# EAGLE design Boost Gauge MainBoard (EAGLE 9.6.2)
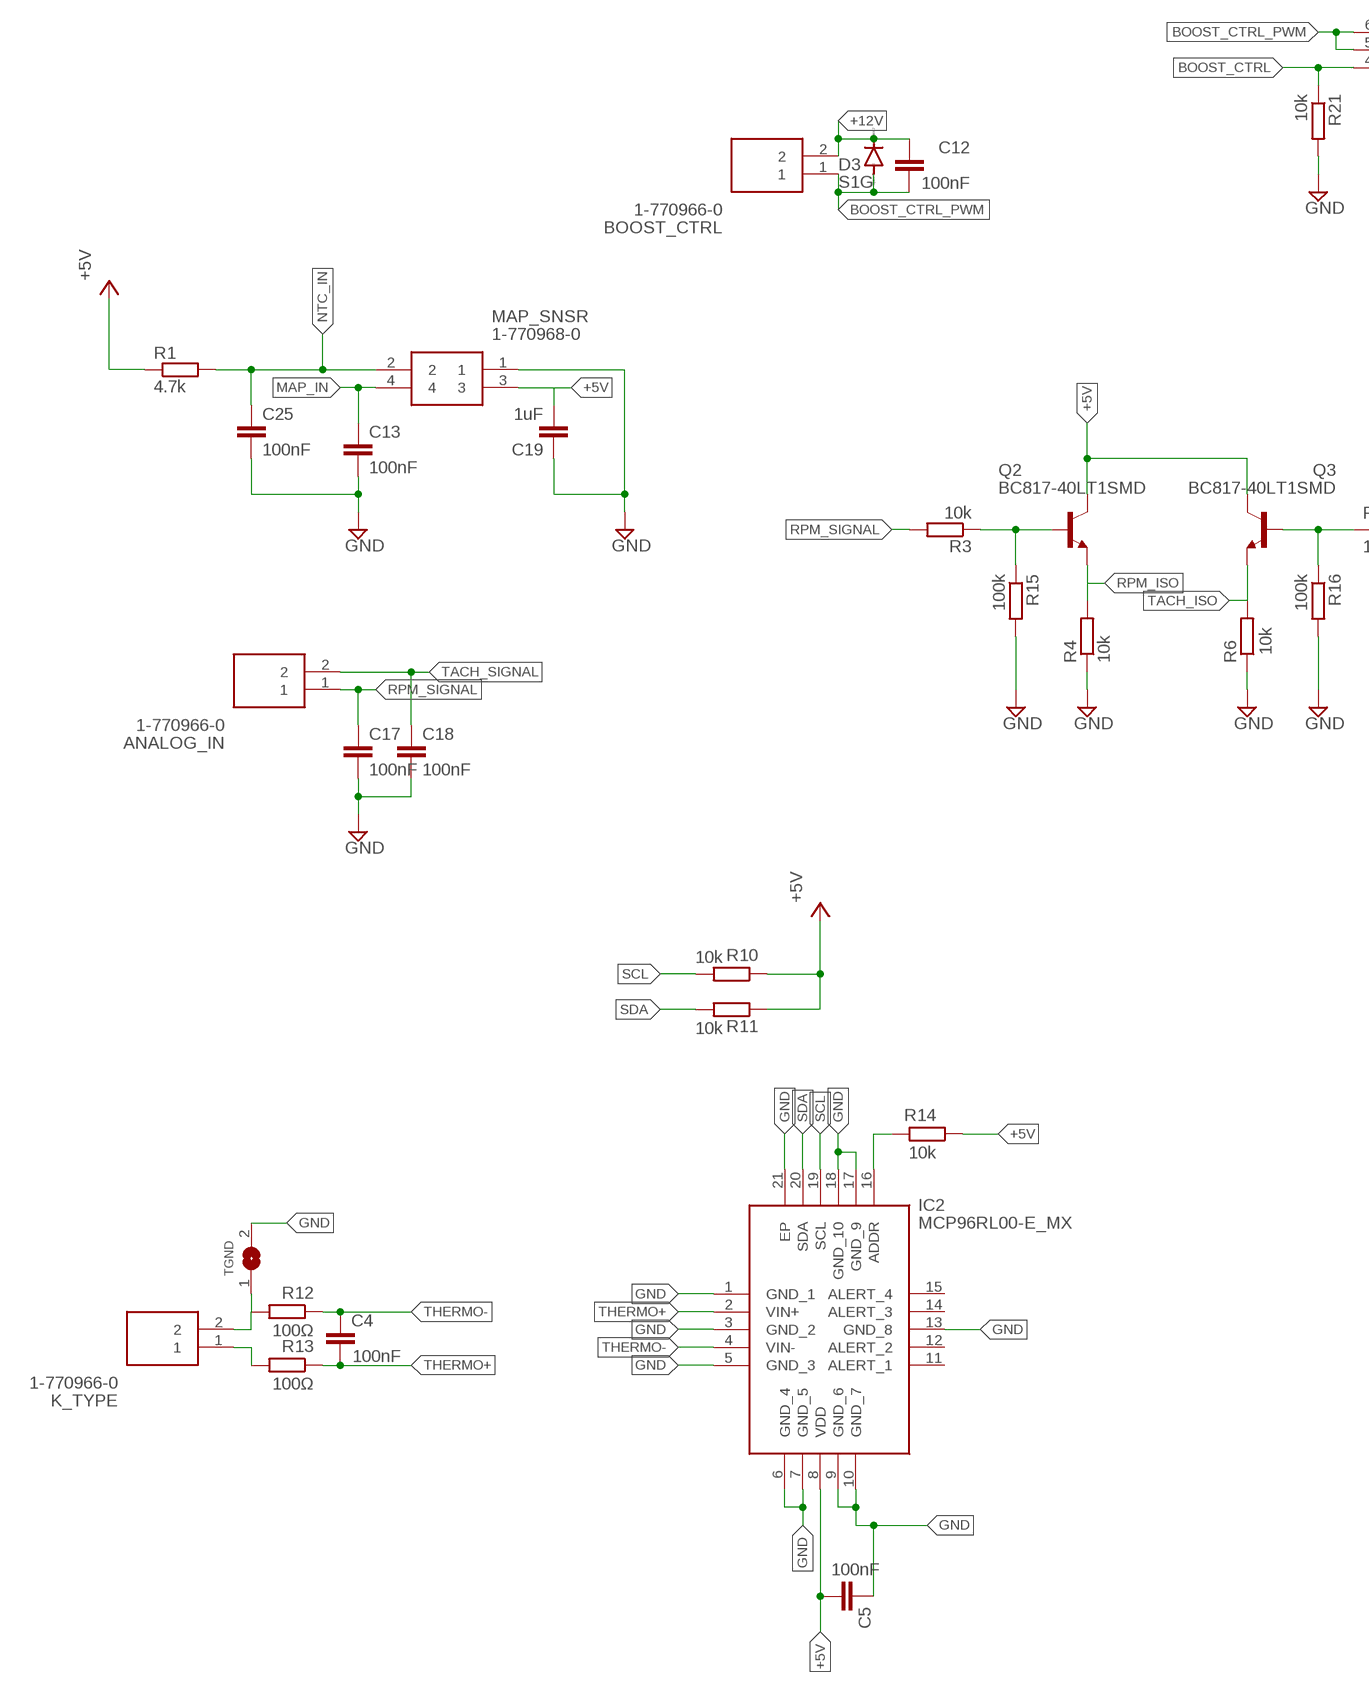
[diagram p0: schematic, sheet 1, part 1 of 2]
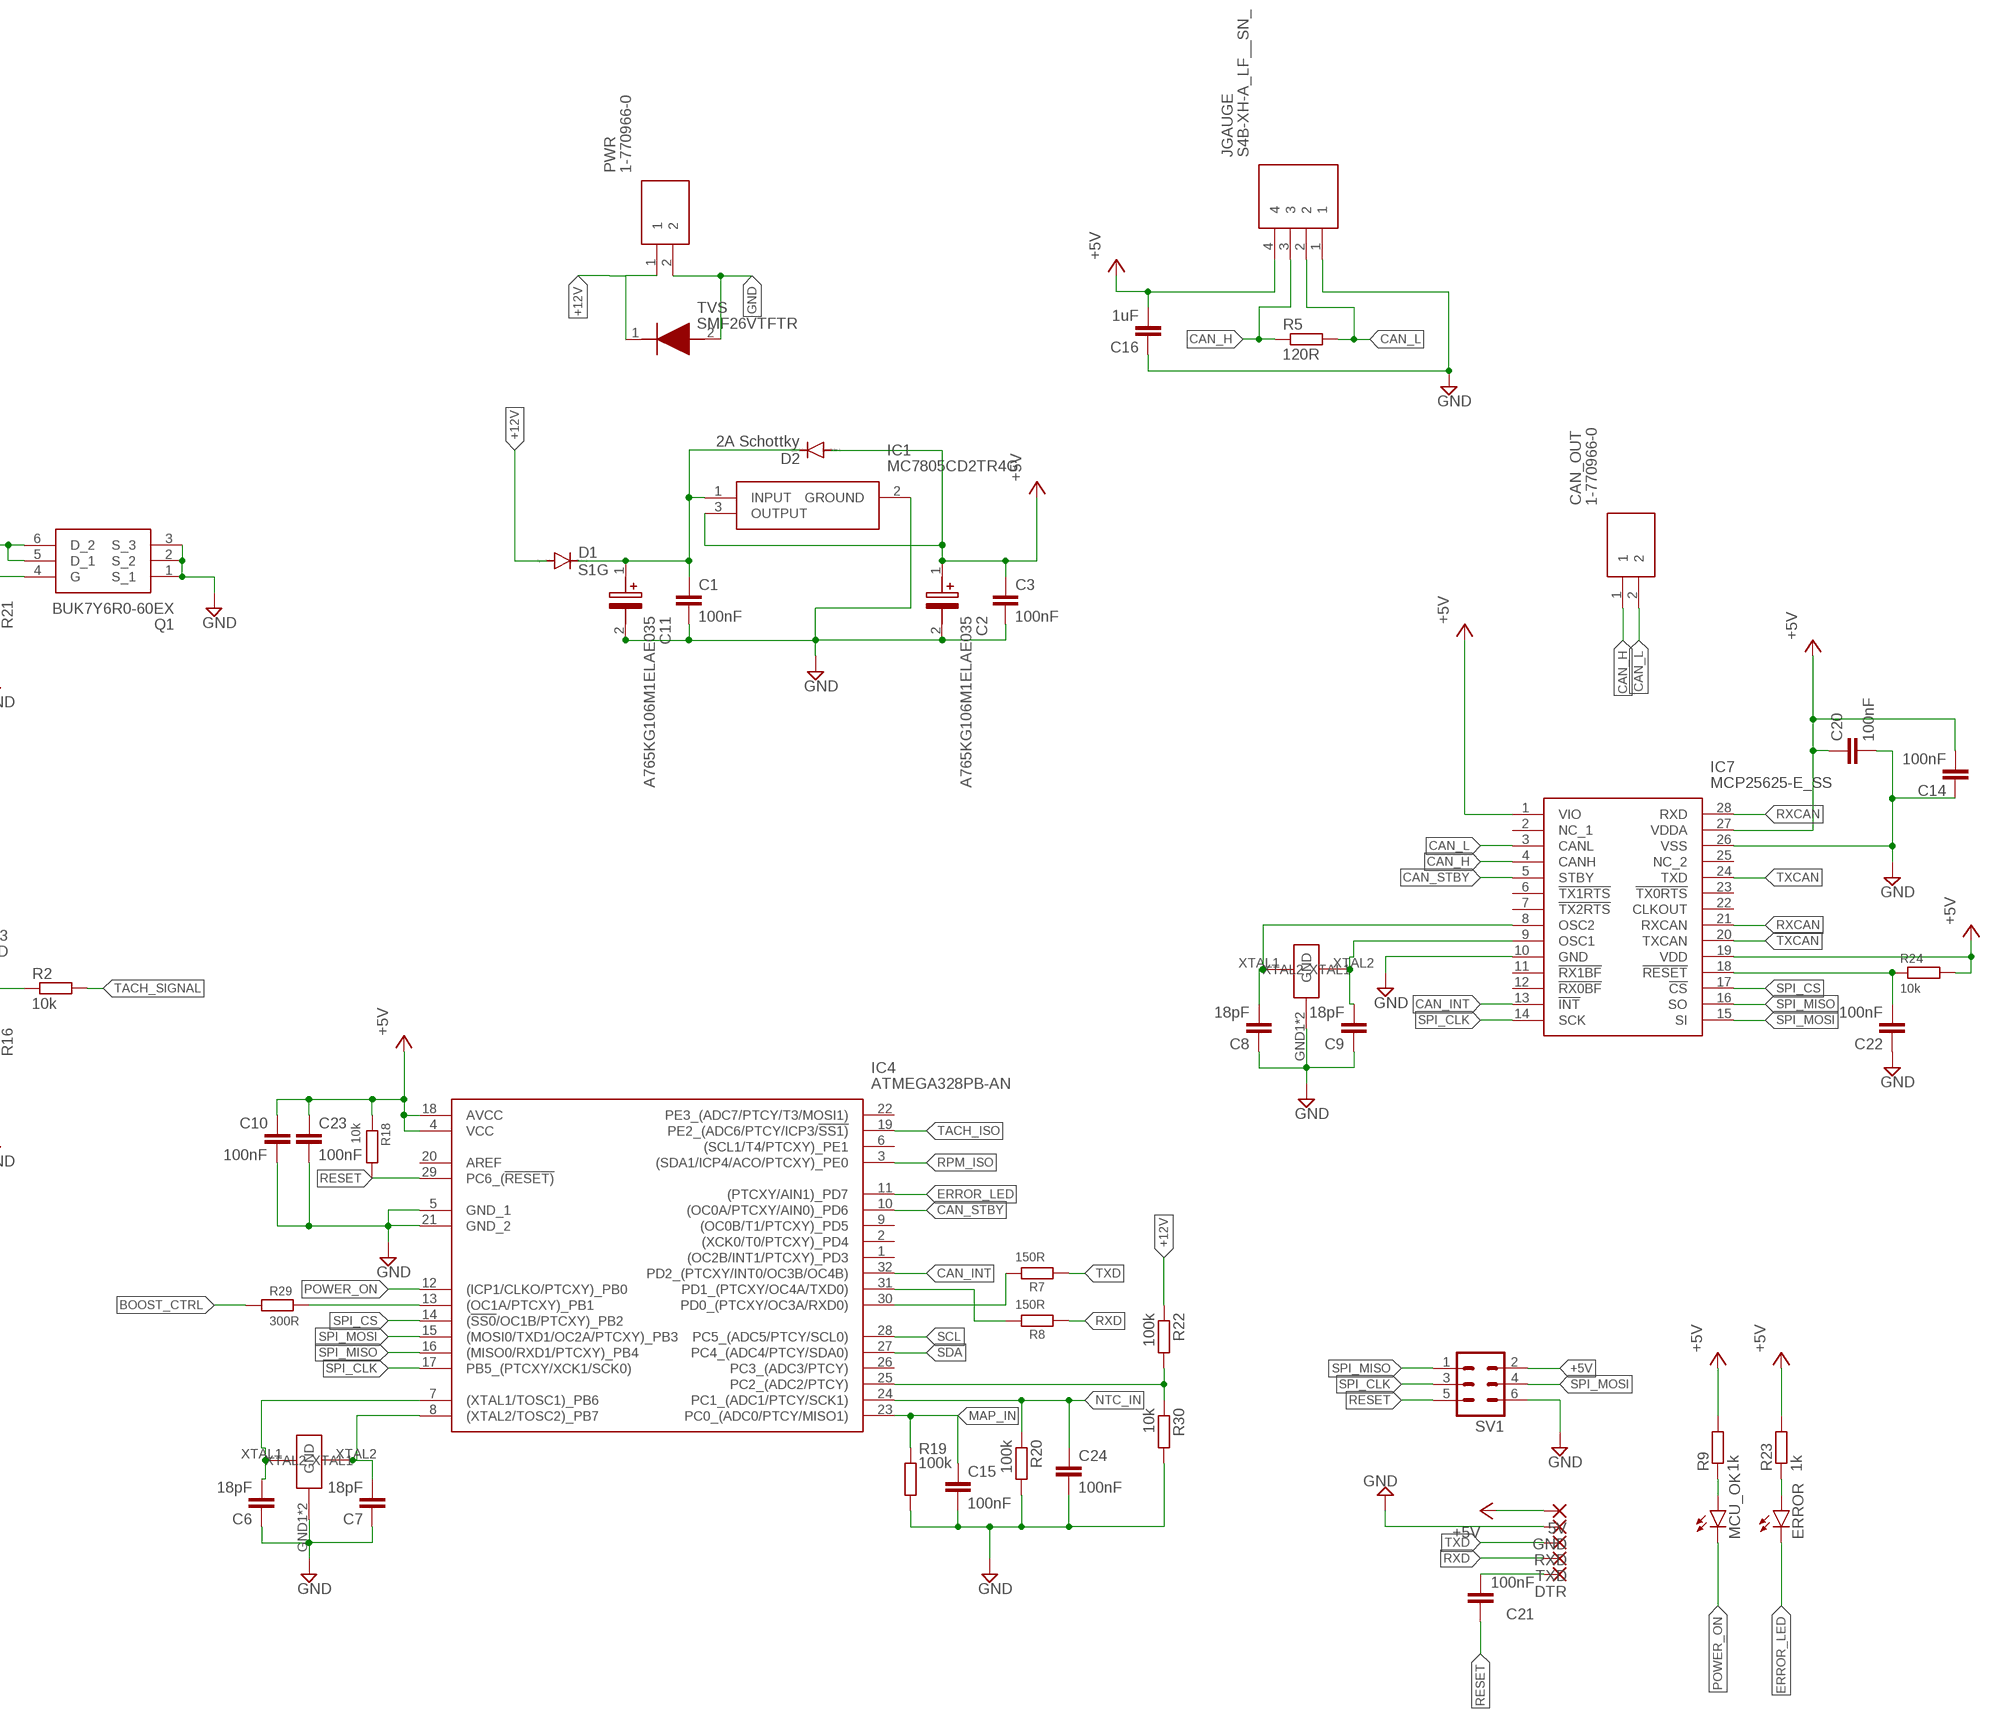
[diagram p1: schematic, sheet 1, part 2 of 2]

## Parts
5V  1,6/0,9  [1,6/0,9]
ANALOG_IN  1-770966-0  [17709660]
BOOST_CTRL  1-770966-0  [17709660]
C1  100nF  C-EUC0805  [C0805]
C2  A765KG106M1ELAE035  [CAPAE830X730N]
C3  100nF  C-EUC0805  [C0805]
C4  100nF  C-EUC0805  [C0805]
C5  100nF  C-EUC0805  [C0805]
C6  18pF  C-EUC0805  [C0805]
C7  18pF  C-EUC0805  [C0805]
C8  18pF  C-EUC0805  [C0805]
C9  18pF  C-EUC0805  [C0805]
C10  100nF  C-EUC0805  [C0805]
C11  A765KG106M1ELAE035  [CAPAE830X730N]
C12  100nF  C-EUC0805  [C0805]
C13  100nF  C-EUC0805  [C0805]
C14  100nF  C-EUC0805  [C0805]
C15  100nF  C-EUC0805  [C0805]
C16  1uF  C-EUC0805  [C0805]
C17  100nF  C-EUC0805  [C0805]
C18  100nF  C-EUC0805  [C0805]
C19  1uF  C-EUC0805  [C0805]
C20  100nF  C-EUC0805  [C0805]
C21  100nF  C-EUC0805  [C0805]
C22  100nF  C-EUC0805  [C0805]
C23  100nF  C-EUC0805  [C0805]
C24  100nF  C-EUC0805  [C0805]
C25  100nF  C-EUC0805  [C0805]
CAN_OUT  1-770966-0  [17709660]
D1  S1G  DIODE-DO-214AC  [DO-214AC]
D2  2A Schottky  DIODE-DO-214AC  [DO-214AC]
D3  S1G  DIODE-DO-214AC  [DO-214AC]
DTR  1,6/0,9  [1,6/0,9]
ERROR  LEDCHIPLED_1206  [CHIPLED_1206]
GND  1,6/0,9  [1,6/0,9]
IC1  MC7805CD2TR4G  [MC7805CD2TR4G]
IC2  MCP96RL00-E_MX  [QFN65P500X500X100-21N]
IC4  ATMEGA328PB-AN  [QFP80P900X900X120-32N]
IC7  MCP25625-E_SS  [SOP65P780X200-28N]
JGAUGE  S4B-XH-A_LF__SN_  [S4BXHALFSN]
K_TYPE  1-770966-0  [17709660]
MAP_SNSR  1-770968-0  [17709680]
MCU_OK  LEDCHIPLED_1206  [CHIPLED_1206]
PWR  1-770966-0  [17709660]
Q1  BUK7Y6R0-60EX  [BUK7Y6R060EX]
Q2  BC817-40LT1SMD  [SOT23-BEC]
Q3  BC817-40LT1SMD  [SOT23-BEC]
R1  4.7k  R-EU_R0805  [R0805]
R2  10k  R-EU_R0805  [R0805]
R3  10k  R-EU_R0805  [R0805]
R4  10k  R-EU_R0805  [R0805]
R5  120R  R-EU_R1206  [R1206]
R6  10k  R-EU_R0805  [R0805]
R7  150R  R-EU_R0805  [R0805]
R8  150R  R-EU_R0805  [R0805]
R9  1k  R-EU_R0805  [R0805]
R10  10k  R-EU_R0805  [R0805]
R11  10k  R-EU_R0805  [R0805]
R12  100Ω  R-EU_R0805  [R0805]
R13  100Ω  R-EU_R0805  [R0805]
R14  10k  R-EU_R0805  [R0805]
R15  100k  R-EU_R0805  [R0805]
R16  100k  R-EU_R0805  [R0805]
R18  10k  R-EU_R0805  [R0805]
R19  100k  R-EU_R0805  [R0805]
R20  100k  R-EU_R0805  [R0805]
R21  10k  R-EU_R0805  [R0805]
R22  100k  R-EU_R0805  [R0805]
R23  1k  R-EU_R0805  [R0805]
R24  10k  R-EU_R0805  [R0805]
R29  300R  R-EU_R0805  [R0805]
R30  10k  R-EU_R0805  [R0805]
RXD  1,6/0,9  [1,6/0,9]
SV1  MA03-2  [MA03-2]
TGND  SOLDERJUMPER  [SOLDERJUMPER_ARROW_NOPASTE]
TVS  SMF26VTFTR  [SMF26VTFTR]
TXD  1,6/0,9  [1,6/0,9]
U$4  E3X160181X04  [E3X160181X04]
U$5  E3X160181X04  [E3X160181X04]

## Nets
+5V: 5V.1(P) C2.1(+) C3.1 C5.2 C10.1 C14.2 C16.2 C19.2 C20.1 C23.1 D2.A IC1.3(OUTPUT) IC2.8(VDD) IC4.4(VCC) IC4.18(AVCC) IC7.1(VIO) IC7.19(VDD) IC7.27(VDDA) JGAUGE.4 MAP_SNSR.3 Q2.C Q3.C R1.1 R9.2 R10.1 R11.1 R14.1 R18.1 R23.2 R24.2 SV1.2
+12V: BOOST_CTRL.2 C12.2 D1.A D3.C PWR.1 R22.1 TVS.1(K)
BOOST_CTRL: Q1.4(G) R21.1 R29.1
BOOST_CTRL_PWM: BOOST_CTRL.1 C12.1 D3.A Q1.5(D_1) Q1.6(D_2)
CAN_H: CAN_OUT.1 IC7.4(CANH) JGAUGE.3 R5.1
CAN_INT: IC4.32(PD2_(PTCXY/INT0/OC3B/OC4B)) IC7.13(!INT)
CAN_L: CAN_OUT.2 IC7.3(CANL) JGAUGE.2 R5.2
CAN_STBY: IC4.10((OC0A/PTCXY/AIN0)_PD6) IC7.5(STBY)
DTR: C21.2 DTR.1(P)
ERROR_LED: ERROR.C IC4.11((PTCXY/AIN1)_PD7)
GND: C1.2 C2.2(-) C3.2 C5.1 C6.1 C7.1 C8.1 C9.1 C10.2 C11.2(-) C13.2 C14.1 C15.2 C16.1 C17.2 C18.2 C19.1 C20.2 C22.1 C23.2 C24.2 C25.2 GND.1(P) IC1.2(GROUND) IC2.1(GND_1) IC2.3(GND_2) IC2.5(GND_3) IC2.6(GND_4) IC2.7(GND_5) IC2.9(GND_6) IC2.10(GND_7) IC2.13(GND_8) IC2.17(GND_9) IC2.18(GND_10) IC2.21(EP) IC4.5(GND_1) IC4.21(GND_2) IC7.10(GND) IC7.26(VSS) JGAUGE.1 MAP_SNSR.1 PWR.2 Q1.1(S_1) Q1.2(S_2) Q1.3(S_3) R4.1 R6.1 R15.2 R16.2 R19.2 R20.2 R21.2 R30.2 SV1.6 TGND.2 TVS.2(A) U$4.GND1(GND) U$4.GND2(GND) U$5.GND1(GND) U$5.GND2(GND)
MAP_IN: C13.1 C15.1 IC4.23(PC0_(ADC0/PTCY/MISO1)) MAP_SNSR.4 R19.1
N$1: C9.2 IC7.9(OSC1) U$5.XTAL2
N$3: Q2.B R3.1 R15.1
N$4: Q3.B R2.1 R16.1
N$5: C8.2 IC7.8(OSC2) U$5.XTAL1
N$6: C1.1 C11.1(+) D1.C D2.C IC1.1(INPUT)
N$8: IC4.31(PD1_(PTCXY/OC4A/TXD0)) R8.2
N$9: IC4.30(PD0_(PTCXY/OC3A/RXD0)) R7.2
N$10: MCU_OK.A R9.1
N$11: K_TYPE.1 R13.2
N$12: ERROR.A R23.1
N$13: C22.2 IC7.18(!RESET) R24.1
N$15: IC2.16(ADDR) R14.2
N$23: IC4.25(PC2_(ADC2/PTCY)) R22.2 R30.1
N$24: C7.2 IC4.8((XTAL2/TOSC2)_PB7) U$4.XTAL2
N$25: C6.2 IC4.7((XTAL1/TOSC1)_PB6) U$4.XTAL1
N$32: IC4.13((OC1A/PTCXY)_PB1) R29.2
NTC_IN: C24.1 C25.1 IC4.24(PC1_(ADC1/PTCY/SCK1)) MAP_SNSR.2 R1.2 R20.1
POWER_ON: IC4.12((ICP1/CLKO/PTCXY)_PB0) MCU_OK.C
RESET: C21.1 IC4.29(PC6_(!RESET)) R18.2 SV1.5
RPM_ISO: IC4.3((SDA1/ICP4/ACO/PTCXY)_PE0) Q2.E R4.2
RPM_SIGNAL: ANALOG_IN.1 C17.1 R3.2
RXCAN: IC7.21(RXCAN) IC7.28(RXD)
RXD: R8.1 TXD.1(P)
SCL: IC2.19(SCL) IC4.28(PC5_(ADC5/PTCY/SCL0)) R10.2
SDA: IC2.20(SDA) IC4.27(PC4_(ADC4/PTCY/SDA0)) R11.2
SPI_CLK: IC4.17(PB5_(PTCXY/XCK1/SCK0)) IC7.14(SCK) SV1.3
SPI_CS: IC4.14((!SS0!/OC1B/PTCXY)_PB2) IC7.17(!CS)
SPI_MISO: IC4.16((MISO0/RXD1/PTCXY)_PB4) IC7.16(SO) SV1.1
SPI_MOSI: IC4.15((MOSI0/TXD1/OC2A/PTCXY)_PB3) IC7.15(SI) SV1.4
TACH_ISO: IC4.19(PE2_(ADC6/PTCY/ICP3/!SS1)) Q3.E R6.2
TACH_SIGNAL: ANALOG_IN.2 C18.1 R2.2
THERMO+: C4.2 IC2.2(VIN+) R13.1
THERMO-: C4.1 IC2.4(VIN-) R12.1
THERMO-1: K_TYPE.2 R12.2 TGND.1
TXCAN: IC7.20(TXCAN) IC7.24(TXD)
TXD: R7.1 RXD.1(P)
Unconnected: IC2.11(ALERT_1) IC2.12(ALERT_2) IC2.14(ALERT_3) IC2.15(ALERT_4) IC4.1((OC2B/INT1/PTCXY)_PD3) IC4.2((XCK0/T0/PTCXY)_PD4) IC4.6((SCL1/T4/PTCXY)_PE1) IC4.9((OC0B/T1/PTCXY)_PD5) IC4.20(AREF) IC4.22(PE3_(ADC7/PTCY/T3/MOSI1)) IC4.26(PC3_(ADC3/PTCY)) IC7.2(NC_1) IC7.6(!TX1RTS) IC7.7(!TX2RTS) IC7.11(!RX1BF) IC7.12(!RX0BF) IC7.22(CLKOUT) IC7.23(!TX0RTS) IC7.25(NC_2)

## Library data of the parts
5V DTR GND RXD TXD = wirepad:1,6/0,9: THROUGH-HOLE PAD
ANALOG_IN BOOST_CTRL CAN_OUT K_TYPE PWR = 1-770966-0:1-770966-0: TE Connectivity MATE-N-LOK Series, 4.14mm Pitch 2 Way Right Angle Heavy Duty Power Connector, Solder Termination, 9.5A Source: Datasheet <https://www.te.com/commerce/DocumentDelivery/DDEController?Action=showdoc&DocId=Customer Drawing770966G1pdfEnglishENG_CD_770966_G1.pdf1-770966-0>; DESCRIPTION: TE Connectivity MATE-N-LOK Series, 4.14mm Pitch 2 Way Right Angle Heavy Duty Power Connector, Solder Termination, 9.5A; HEIGHT: 7.77mm; MANUFACTURER_NAME: TE Connectivity; MANUFACTURER_PART_NUMBER: 1-770966-0; MOUSER_PART_NUMBER: 571-1-770966-0; MOUSER_PRICE-STOCK: https://www.mouser.co.uk/ProductDetail/TE-Connectivity-AMP/1-770966-0?qs=qXO2HHLAcoJiZj6lD7oupQ%3D%3D
C1 C3-C10 C12-C25 = rcl:C-EU: CAPACITOR, European symbol; SPICEPREFIX: C
C2 C11 = A765KG106M1ELAE035:A765KG106M1ELAE035: A765, Aluminum, Polymer Aluminum, 10 uF, 20%, 25 VDC, -55/+105C, 105C, -55C, 105C, 2,000 Hrs, 35 mOhms, 125 uA, 8mm, 7mm Source: Datasheet <https://content.kemet.com/datasheets/KEM_A4070_A765.pdf>; DESCRIPTION: A765, Aluminum, Polymer Aluminum, 10 uF, 20%, 25 VDC, -55/+105C, 105C, -55C, 105C, 2,000 Hrs, 35 mOhms, 125 uA, 8mm, 7mm; HEIGHT: 7.3mm; MANUFACTURER_NAME: KEMET; MANUFACTURER_PART_NUMBER: A765KG106M1ELAE035; MOUSER_PART_NUMBER: 80-A765KG106M1ELAE35; MOUSER_PRICE-STOCK: https://www.mouser.co.uk/ProductDetail/KEMET/A765KG106M1ELAE035?qs=W%2FMpXkg%252BdQ53XAW4ytn24A%3D%3D
D1-D3 = diode:DIODE-: DIODE
ERROR MCU_OK = led:LED: LED OSRAM: - CHIPLED LG R971, LG N971, LY N971, LG Q971, LY Q971, LO R971, LY R971 LH N974, LH R974 LS Q976, LO Q976, LY Q976 LO Q996 - Hyper CHIPLED LW Q18S LB Q993, LB Q99A, LB R99A - SideLED LS A670, LO A670, LY A670, LG A670, LP A670 LB A673, LV A673, LT A673, LW A673 LH A674 LY A675 LS A676, LA A676, LO A676, LY A676, LW A676 LS A679, LY A679, LG A679 - Hyper Micro SIDELED® LS Y876, LA Y876, LO Y876, LY Y876 LT Y87S - SmartLED LW L88C, LW L88S LB L89C, LB L89S, LG L890 LS L89K, LO L89K, LY L89K LS L896, LA L896, LO L896, LY L896 - TOPLED LS T670, LO T670, LY T670, LG T670, LP T670 LSG T670, LSP T670, LSY T670, LOP T670, LYG T670 LG T671, LOG T671, LSG T671 LB T673, LV T673, LT T673, LW T673 LH T674 LS T676, LA T676, LO T676, LY T676, LB T676, LH T676, LSB T676, LW T676 LB T67C, LV T67C, LT T67C, LS T67K, LO T67K, LY T67K, LW E67C LS E67B, LA E67B, LO E67B, LY E67B, LB E67C, LV E67C, LT E67C LW T67C LS T679, LY T679, LG T679 LS T770, LO T770, LY T770, LG T770, LP T770 LB T773, LV T773, LT T773, LW T773 LH T774 LS E675, LA E675, LY E675, LS T675 LS T776, LA T776, LO T776, LY T776, LB T776 LHGB T686 LT T68C, LB T68C - Hyper Mini TOPLED® LB M676 - Mini TOPLED Santana® LG M470 LS M47K, LO M47K, LY M47K Source: http://www.osram.convergy.de LUXEON: - LUMILED® LXK2-PW12-R00, LXK2-PW12-S00, LXK2-PW14-U00, LXK2-PW14-V00 LXK2-PM12-R00, LXK2-PM12-S00, LXK2-PM14-U00 LXK2-PE12-Q00, LXK2-PE12-R00, LXK2-PE12-S00, LXK2-PE14-T00, LXK2-PE14-U00 LXK2-PB12-K00, LXK2-PB12-L00, LXK2-PB12-M00, LXK2-PB14-N00, LXK2-PB14-P00, LXK2-PB14-Q00 LXK2-PR12-L00, LXK2-PR12-M00, LXK2-PR14-Q00, LXK2-PR14-R00 LXK2-PD12-Q00, LXK2-PD12-R00, LXK2-PD12-S00 LXK2-PH12-R00, LXK2-PH12-S00 LXK2-PL12-P00, LXK2-PL12-Q00, LXK2-PL12-R00 Source: www.luxeon.com KINGBRIGHT: KA-3528ASYC Source: www.kingbright.com
IC1 = MC7805CD2TR4G:MC7805CD2TR4G: Linear Voltage Regulator IC Positive Fixed 1 Output 1A D2PAK-3 Source: Datasheet <https://www.onsemi.com/pdf/datasheet/mc7800-d.pdf>; DESCRIPTION: Linear Voltage Regulator IC Positive Fixed 1 Output 1A D2PAK-3; HEIGHT: 4.826mm; MANUFACTURER_NAME: onsemi; MANUFACTURER_PART_NUMBER: MC7805CD2TR4G; MOUSER_PART_NUMBER: 863-MC7805CD2TR4G; MOUSER_PRICE-STOCK: https://www.mouser.co.uk/ProductDetail/onsemi/MC7805CD2TR4G?qs=%252B9%2Fcbd0IE0TA2t8QN7DaSw%3D%3D
IC2 = MCP96RL00-E_MX:MCP96RL00-E_MX: Board Mount Temperature Sensors +/- 8.0C Thermocouple to I2C converter in 5mmx5mm QFN. This device supports K, J, T, N, S, E, B, and R type thermocouples. Source: Datasheet <https://componentsearchengine.com/Datasheets/1/MCP96RL00-E_MX.pdf>; DESCRIPTION: Board Mount Temperature Sensors +/- 8.0C Thermocouple to I2C converter in 5mmx5mm QFN. This device supports K, J, T, N, S, E, B, and R type thermocouples.; HEIGHT: 1mm; MANUFACTURER_NAME: Microchip; MANUFACTURER_PART_NUMBER: MCP96RL00-E/MX; MOUSER_PART_NUMBER: 579-MCP96RL00-E/MX; MOUSER_PRICE-STOCK: https://www.mouser.co.uk/ProductDetail/Microchip-Technology/MCP96RL00-E-MX?qs=u16ybLDytRaPVbMV4dyqRg%3D%3D
IC4 = ATMEGA328PB-AN:ATMEGA328PB-AN: MCU 8-bit ATmega AVR RISC 32KB Flash 2.5V/3.3V/5V 32-Pin TQFP Tray Source: Datasheet <http://ww1.microchip.com/downloads/en/DeviceDoc/40001906C.pdf>; DESCRIPTION: MCU 8-bit ATmega AVR RISC 32KB Flash 2.5V/3.3V/5V 32-Pin TQFP Tray; HEIGHT: 1.2mm; MANUFACTURER_NAME: Microchip; MANUFACTURER_PART_NUMBER: ATMEGA328PB-AN; MOUSER_PART_NUMBER: 556-ATMEGA328PB-AN; MOUSER_PRICE-STOCK: https://www.mouser.co.uk/ProductDetail/Microchip-Technology/ATMEGA328PB-AN?qs=jy4bLUHv09gDoS2J01KCIw%3D%3D
IC7 = MCP25625-E_SS:MCP25625-E_SS: CAN Controller with Transceiver SSOP28 Microchip MCP25625-E/SS, CAN Controller 1MBps CAN 2.0, 28-Pin SSOP Source: Datasheet <https://datasheet.datasheetarchive.com/originals/distributors/Datasheets-DGA14/1192265.pdf>; DESCRIPTION: CAN Controller with Transceiver SSOP28 Microchip MCP25625-E/SS, CAN Controller 1MBps CAN 2.0, 28-Pin SSOP; HEIGHT: 2mm; MANUFACTURER_NAME: Microchip; MANUFACTURER_PART_NUMBER: MCP25625-E/SS; MOUSER_PART_NUMBER: 579-MCP25625-E/SS; MOUSER_PRICE-STOCK: https://www.mouser.co.uk/ProductDetail/Microchip-Technology/MCP25625-E-SS?qs=YlpJWyuQ3PO6FRVW%2Ffac7A%3D%3D
JGAUGE = S4B-XH-A_LF__SN_:S4B-XH-A_LF__SN_: XH-2.5mm Header side entry 4 way JST XH Series, Series Number S4B, 2.5mm Pitch 4 Way 1 Row Right Angle PCB Header, Solder Termination, 3A Source: Datasheet <https://www.mouser.co.uk/ProductDetail/JST-Commercial/S4B-XH-ALFSN?qs=QpmGXVUTftEyAvx%2Br33AyQ==&srsltid=AfmBOopXgwHK5vQKy207Eg2VBdixziHXVBrLkW0Mvqq_XGzuQb0VSmKc>; DESCRIPTION: XH-2.5mm Header side entry 4 way JST XH Series, Series Number S4B, 2.5mm Pitch 4 Way 1 Row Right Angle PCB Header, Solder Termination, 3A; HEIGHT: 7mm; MANUFACTURER_NAME: JST (JAPAN SOLDERLESS TERMINALS); MANUFACTURER_PART_NUMBER: S4B-XH-A(LF)(SN); MOUSER_PART_NUMBER: N/A; MOUSER_PRICE-STOCK: https://www.mouser.co.uk/ProductDetail/JST-Commercial/S4B-XH-ALFSN?qs=QpmGXVUTftF7eeJ4yg3VYQ%3D%3D
MAP_SNSR = 1-770968-0:1-770968-0: PCB Mount Header, Right Angle, Wire-to-Board, 4 Position, 4.14 mm [.162 in] Centerline, Fully Shrouded, Tin, Mini-Universal MATE-N-LOK Source: Datasheet <http://www.te.com/commerce/DocumentDelivery/DDEController?Action=srchrtrv&DocNm=770968&DocType=Customer Drawing&DocLang=English&DocFormat=pdf&PartCntxt=1-770968-0>; DESCRIPTION: PCB Mount Header, Right Angle, Wire-to-Board, 4 Position, 4.14 mm [.162 in] Centerline, Fully Shrouded, Tin, Mini-Universal MATE-N-LOK; HEIGHT: 11.86mm; MANUFACTURER_NAME: TE Connectivity; MANUFACTURER_PART_NUMBER: 1-770968-0; MOUSER_PART_NUMBER: 571-1-770968-0; MOUSER_PRICE-STOCK: https://www.mouser.co.uk/ProductDetail/TE-Connectivity-AMP/1-770968-0?qs=qXO2HHLAcoL4Dw11VWHBrA%3D%3D
Q1 = BUK7Y6R0-60EX:BUK7Y6R0-60EX: MOSFET BUK7Y6R0-60E/SOT669/LFPAK Source: Datasheet <https://assets.nexperia.com/documents/data-sheet/BUK7Y6R0-60E.pdf>; DESCRIPTION: MOSFET BUK7Y6R0-60E/SOT669/LFPAK; HEIGHT: 1.2mm; MANUFACTURER_NAME: Nexperia; MANUFACTURER_PART_NUMBER: BUK7Y6R0-60EX; MOUSER_PART_NUMBER: 771-BUK7Y6R0-60EX; MOUSER_PRICE-STOCK: https://www.mouser.co.uk/ProductDetail/Nexperia/BUK7Y6R0-60EX?qs=cbprxTG2Yq9UL%2F2WHaKVPw%3D%3D
Q2 Q3 = transistor-npn:BC817*: NPN Transistor
R1-R16 R18-R24 R29 R30 = rcl:R-EU_: RESISTOR, European symbol; SPICEPREFIX: R
SV1 = con-lstb:MA03-2: PIN HEADER; OC_FARNELL: unknown; OC_NEWARK: unknown
TGND = microbuilder:SOLDERJUMPER: SMD Solder JUMPER Solder the two pads together to create a connection, or remove the solder to break it. REFLOW - Use this footprint for solder paste and reflow ovens. WAVE - Use this footprint for hand-soldering (larger pads). CLOSED - Has a trace between the two pads to ensure it is closed by default. The trace needs to be cut to disable the jumper, and can be closed again by creating a solder bridge between the two pads.; BOM: EXCLUDE
TVS = SMF26VTFTR:SMF26VTFTR: Transient Voltage Suppressor (AEC-Q101 Qualified) Source: Datasheet <https://fscdn.rohm.com/en/products/databook/datasheet/discrete/diode/zener/smf26vtftr-e.pdf>; DESCRIPTION: Transient Voltage Suppressor (AEC-Q101 Qualified); HEIGHT: 0.9mm; MANUFACTURER_NAME: ROHM Semiconductor; MANUFACTURER_PART_NUMBER: SMF26VTFTR; MOUSER_PART_NUMBER: 755-SMF26VTFTR; MOUSER_PRICE-STOCK: https://www.mouser.co.uk/ProductDetail/ROHM-Semiconductor/SMF26VTFTR?qs=HXFqYaX1Q2zSWViY1YLSPg%3D%3D
U$4 U$5 = E3X160181X04:E3X160181X04

## Board
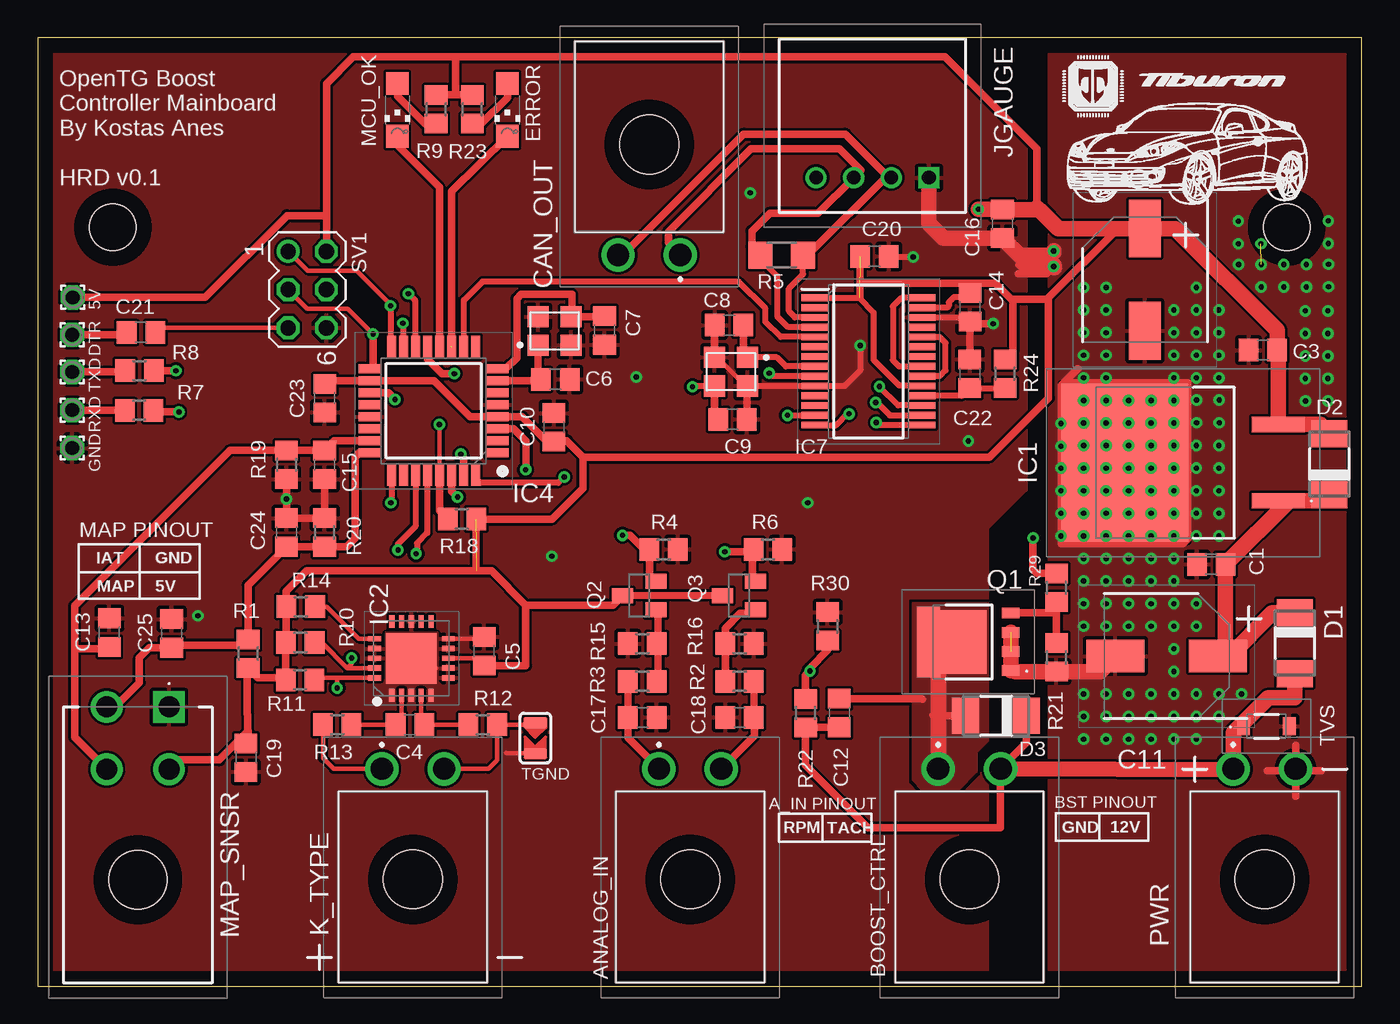
[diagram p2: board, top side]
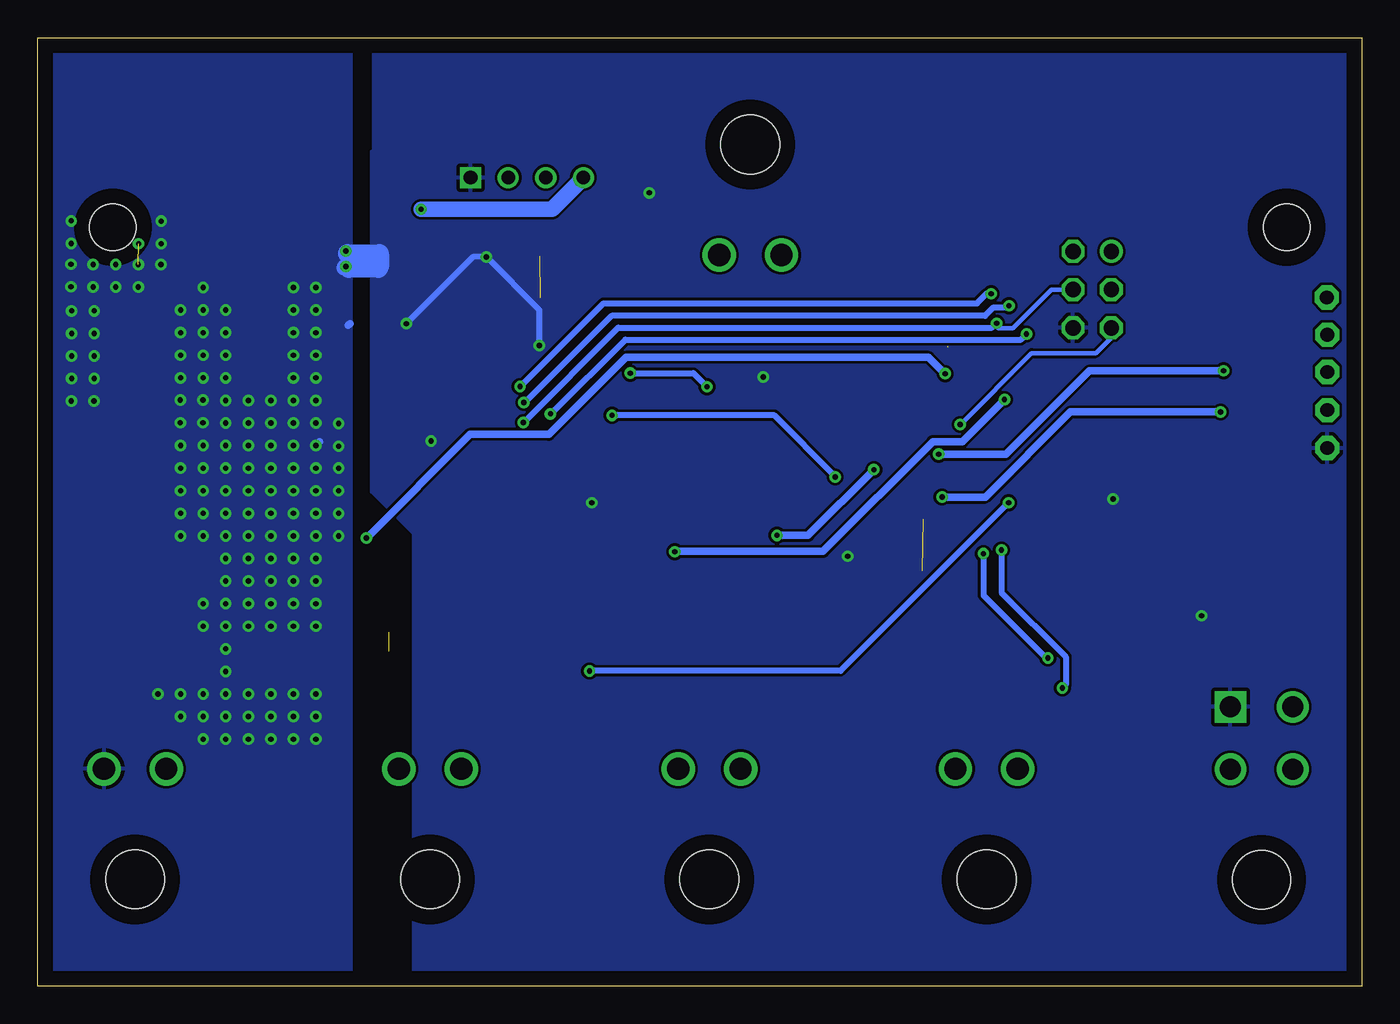
[diagram p3: board, bottom side, seen from below]

Size 88 x 63 mm. Coordinates in mm from the lower left corner, seen from the top.
Outline: 0,0 88,0 88,63 0,63 0,0
Copper layers (1*16): Top 0.035mm / dielectric 1.5mm / Bottom 0.035mm
Design rules "default *": minimum track width 6mil, minimum drill 0.35mm, track to track 7mil, track to pad 6mil, pad to pad 6mil, via to via 6mil, smd to smd 6mil, copper to edge 40mil, drill to drill 6mil, minimum pad ring 1mil, minimum via ring 8mil, stop-mask expansion 4mil, vias tented up to drill 0mil, thermal gap 10mil
Holes 3.1 mm at 83,50.4 5,50.4

### Footprints (pad centres in the part's own frame; a part is rotated, then mirrored left to right if it is on the bottom)
1,6/0,9 = drill 0.914 pad 1.6 octagon: 1 0,0
17709660 = drill 1.48 pad 2.22: 1 0,0; 2 4.14,0 | hole 3.91: 2.07,-7.34
C0805 = smd 1.3 x 1.5: 1 -0.95,0; 2 0.95,0
CAPAE830X730N = smd 3.85 x 2.15: 1 -3.4,0; 2 3.4,0
DO-214AC = smd 1.8 x 2.4: A 2.025,0; C -2.025,0
CHIPLED_1206 = smd 1.5 x 1.5: A 0,-1.75; C 0,1.75
MC7805CD2TR4G = smd 1.016 x 3.504: 1 -2.54,-6.059; 3 2.54,-6.059 | smd 10.49 x 8.38: 2 0,4.154
QFN65P500X500X100-21N = smd 0.85 x 0.35: 1 -2.45,1.3; 2 -2.45,0.65; 3 -2.45,0; 4 -2.45,-0.65; 5 -2.45,-1.3; 11 2.45,-1.3; 12 2.45,-0.65; 13 2.45,0; 14 2.45,0.65; 15 2.45,1.3 | smd 0.35 x 0.85: 6 -1.3,-2.45; 7 -0.65,-2.45; 8 0,-2.45; 9 0.65,-2.45; 10 1.3,-2.45; 16 1.3,2.45; 17 0.65,2.45; 18 0,2.45; 19 -0.65,2.45; 20 -1.3,2.45 | smd 3.35 x 3.35: 21 0,0
QFP80P900X900X120-32N = smd 1.475 x 0.6: 1 -4.238,2.8; 2 -4.238,2; 3 -4.238,1.2; 4 -4.238,0.4; 5 -4.238,-0.4; 6 -4.238,-1.2; 7 -4.238,-2; 8 -4.238,-2.8; 17 4.238,-2.8; 18 4.238,-2; 19 4.238,-1.2; 20 4.238,-0.4; 21 4.238,0.4; 22 4.238,1.2; 23 4.238,2; 24 4.238,2.8 | smd 0.6 x 1.475: 9 -2.8,-4.238; 10 -2,-4.238; 11 -1.2,-4.238; 12 -0.4,-4.238; 13 0.4,-4.238; 14 1.2,-4.238; 15 2,-4.238; 16 2.8,-4.238; 25 2.8,4.238; 26 2,4.238; 27 1.2,4.238; 28 0.4,4.238; 29 -0.4,4.238; 30 -1.2,4.238; 31 -2,4.238; 32 -2.8,4.238
SOP65P780X200-28N = smd 1.8 x 0.45: 1 -3.55,4.225; 2 -3.55,3.575; 3 -3.55,2.925; 4 -3.55,2.275; 5 -3.55,1.625; 6 -3.55,0.975; 7 -3.55,0.325; 8 -3.55,-0.325; 9 -3.55,-0.975; 10 -3.55,-1.625; 11 -3.55,-2.275; 12 -3.55,-2.925; 13 -3.55,-3.575; 14 -3.55,-4.225; 15 3.55,-4.225; 16 3.55,-3.575; 17 3.55,-2.925; 18 3.55,-2.275; 19 3.55,-1.625; 20 3.55,-0.975; 21 3.55,-0.325; 22 3.55,0.325; 23 3.55,0.975; 24 3.55,1.625; 25 3.55,2.275; 26 3.55,2.925; 27 3.55,3.575; 28 3.55,4.225
S4BXHALFSN = drill 0.9 pad 1.4 square: 1 0,0 | drill 0.9 pad 1.4: 2 -2.5,0; 3 -5,0; 4 -7.5,0
17709680 = drill 1.4 pad 2.1 square: 1 0,0 | drill 1.4 pad 2.1: 2 -4.14,0; 3 0,-4.14; 4 -4.14,-4.14 | hole 3.86: -2.07,-11.48
BUK7Y6R060EX = smd 0.7 x 1.15: 1 -1.905,-2.737; 2 -0.635,-2.737; 3 0.635,-2.737; 4 1.905,-2.737 | smd 4.7 x 1.5: 5 0,2.737 | smd 4.2 x 3.1: 6 0,0.438
SOT23-BEC = smd 1 x 1.4: B -0.95,-1.1; C 0,1.1; E 0.95,-1.1
R0805 = smd 1.3 x 1.5: 1 -0.95,0; 2 0.95,0
R1206 = smd 1.6 x 1.803: 1 -1.422,0; 2 1.422,0
MA03-2 = drill 1.016: 1 -2.54,-1.27 | drill 1.016 octagon: 2 -2.54,1.27; 3 0,-1.27; 4 0,1.27; 5 2.54,-1.27; 6 2.54,1.27
SOLDERJUMPER_ARROW_NOPASTE = smd 0.762 x 1.524: 1 -1.016,0; 2 1.016,0
SMF26VTFTR = smd 1.2 x 0.85: 1 0,1.525; 2 0,-1.525
E3X160181X04 = smd 1.4 x 1.4: GND1 -1.1,0.9; GND2 1.1,-1; XTAL1 -1.1,-1; XTAL2 1.1,0.9

### Placement (x,y rotation side)
5V  2.34,45.74 270 top
ANALOG_IN  41.29,14.43 0 top
BOOST_CTRL  59.85,14.43 0 top
C1  77.99,28.01 180 top
C2  73.58,46.92 270 top
C3  81.42,42.25 180 top
C4  24.74,17.36 180 top
C5  29.68,22.24 270 top
C6  34.4,40.3 180 top
C7  37.67,43.55 90 top
C8  45.95,43.9 0 top
C9  46.18,37.64 180 top
C10  34.31,37.11 90 top
C11  75.03,21.92 180 top
C12  53.28,18.14 270 top
C13  4.76,23.48 90 top
C14  61.96,45.09 90 top
C15  19.07,34.63 270 top
C16  64.11,50.63 90 top
C17  40.18,17.84 0 top
C18  46.65,17.84 180 top
C19  13.85,15.17 90 top
C20  55.61,48.47 0 top
C21  6.87,43.42 180 top
C22  61.94,40.67 270 top
C23  19.08,39.05 270 top
C24  16.54,30.13 90 top
C25  8.91,23.42 90 top
CAN_OUT  42.71,48.56 180 top
D1  83.55,22.78 270 top
D2  85.84,34.67 90 top
D3  63.68,17.95 180 top
DTR  2.3,43.26 270 top
ERROR  31.22,58.2 180 top
GND  2.3,35.74 270 top
IC1  76.39,34.77 90 top
IC2  24.84,21.77 90 top
IC4  26.31,38.21 180 top
IC7  55.21,41.49 0 top
JGAUGE  59.23,53.7 0 top
K_TYPE  22.87,14.43 0 top
MAP_SNSR  8.73,18.54 0 top
MCU_OK  23.91,58.2 180 top
PWR  79.45,14.43 0 top
Q1  61.93,22.86 90 top
Q2  39.98,25.94 90 top
Q3  46.6,25.94 90 top
R1  13.99,22.08 90 top
R2  46.65,20.24 0 top
R3  40.18,20.24 180 top
R4  41.6,29 180 top
R5  49.45,48.55 0 top
R6  48.53,29 180 top
R7  6.75,38.24 0 top
R8  6.77,40.88 0 top
R9  26.48,58.24 90 top
R10  17.46,22.82 0 top
R11  17.44,20.34 0 top
R12  29.58,17.36 0 top
R13  19.91,17.36 180 top
R14  17.49,25.2 0 top
R15  40.18,22.74 180 top
R16  46.65,22.74 0 top
R18  28.2,31.02 180 top
R19  16.54,34.63 270 top
R20  19.07,30.13 90 top
R21  67.71,21.83 270 top
R22  51.03,18.13 90 top
R23  28.88,58.24 90 top
R24  64.28,40.67 90 top
R29  67.71,26.46 90 top
R30  52.5,23.89 90 top
RXD  2.3,38.26 270 top
SV1  17.92,46.26 270 top
TGND  33.07,16.47 270 top
TVS  81.66,17.25 90 top
TXD  2.3,40.79 270 top
U$4  34.36,43.57 0 top
U$5  46.08,40.76 180 top

### Tracks (layer width: path | path; a pad name or v marks a point on that pad's centre or on a via)
+5V  (via drill 0.35)  (2 unrouted)
  Top 0.305: R14.1 16.51,25.23 16.51,25.26 | IC2.8 29.29,21.77 29.77,21.29
  Top 0.406: C14.2 61.68,45.76 60.89,45.76 60.55,45.42 60.55,45.17 60.45,45.06 IC7.27 | IC7.1 54.66,45.72 | IC7.19 58.74,39.88 57.26,39.88 55.55,41.59 55.55,44.76 54.6,45.7 | C19.2 13.99,16.26
  Top 0.508: C10.1 34.22,36.25 33.76,36.25 32.2,37.81 IC4.4 28.75,37.81 26.35,40.21 IC4.18 19.29,40.21 C23.1 19.05,40.03 | 54.66,46.66 54.66,45.72 | C5.2 29.77,21.29 32.44,21.29 32.44,25.31 | 71.78,50.32 67.17,45.7 67.17,45.63 | MAP_SNSR.3 9.36,15.03 12.07,15.03 13.97,16.93 | 13.97,16.93 13.99,16.95 13.99,16.26 | 16.49,22.8 R11.1 16.34,20.49 14.63,20.49 R1.1 13.94,21.08 13.94,18.04 13.97,18.01 13.97,16.93 | R10.1 16.51,25.26 16.51,26.21 17.88,27.58 29.13,27.58 29.13,31 R18.1 34.19,31.02 36.24,33.07 36.24,35.14 | 29.19,27.58 30.17,27.58 32.44,25.31 | R23.2 27.75,59.21 | 27.75,59.21 26.5,59.21 R9.2 27.34,59.19 | 66.42,51.7 66.42,55.6 60.29,61.73 27.77,61.73 | SV1.2 19.19,51.18 | 19.19,51.18 19.19,59.94 20.98,61.73 27.77,61.73 | 5V.1 11.13,45.74 16.57,51.18 19.19,51.18 | 67.17,45.63 64.79,45.63 | 64.79,45.63 64.75,45.59 63.66,46.69 61.33,46.69 61.96,46.06 C14.2 61.3,46.7 54.7,46.7 54.66,46.66 | 64.79,45.63 64.79,42.13 R24.2 | C20.1 54.66,46.66 | 34.56,35.91 C10.1 | 36.24,35.14 35.15,36.23 34.38,36.23 C10.1 | 27.75,59.21 27.77,59.23 27.77,61.73 | 36.24,35.14 63.26,35.14 67.17,39.05 67.17,45.63 | Q3.C 45.49,25.93 Q2.C 38.24,25.3 32.46,25.29 32.44,25.31
  Top 1.016: 85.39,37.14 D2.A 85.22,37.31 IC1.3 82.45,42.17 C3.1 82.37,43.55 75.6,50.32 C2.1 71.78,50.32 67.81,50.32 66.56,51.58 66.53,51.58 | 16.49,22.8 R10.1 | v62.52,51.6 64.11,51.6 C16.2 66.53,51.58 | 66.42,51.7 66.53,51.58
  Bottom 1.016: v62.52,51.6 53.83,51.6 JGAUGE.4
+12V
  Top 0.508: D3.C 65.7,16.14 BOOST_CTRL.2 63.99,10.5 55.18,10.5 51.03,14.65 R22.1 C12.2 | TVS.1 79.47,16.58 79.45,16.58
  Top 1.016: BOOST_CTRL.2 79.36,14.38 PWR.1 79.45,16.58 79.45,16.83 81.77,19.15 83.55,19.15 D1.A
BOOST_CTRL
  Top 0.508: Q1.4 64.69,24.79 67.67,24.79 67.7,24.75 | 67.7,24.75 R21.1 67.69,22.8 | R29.1 67.7,24.75
BOOST_CTRL_PWM
  Top 0.508: 59.5,18 59.55,17.95 D3.A | C12.1 58.76,19.09 58.8,19.05
  Top 1.016: Q1.5 59.85,22.2 BOOST_CTRL.1
  pour Top (no thermals): 63.16,25.46 63.16,16.27 62.4,15.51 62.4,14.23 61.22,13.05 58.77,13.05 58.15,13.67 58.15,25.46
CAN_H
  Top 0.406: IC7.4 49.88,43.77 49.14,44.5 49.14,47.16 48.03,48.27 R5.1 48.02,48.56
  Top 0.508: R5.1 47.46,49.12 47.46,50.15 48.65,51.34 51.87,51.34 JGAUGE.3 54.7,54.17 53.27,55.61 47.4,55.61 41.91,50.12 41.91,49.36 CAN_OUT.1
CAN_INT  (via drill 0.35)
  Top 0.406: v35,33.82 34.6,33.42 29.41,33.42 29.11,33.72 IC4.32 | v49.83,37.91 IC7.13
  Bottom 0.406: v35,33.82 35,33.88 39.03,37.91 v49.83,37.91
CAN_L
  Top 0.406: IC7.3 50.33,44.41 49.93,44.81 49.93,46.34 50.87,47.28 50.87,48.44 | 50.87,48.44 R5.2 | JGAUGE.2 56.33,53.7 | 51.3,48.87 50.87,48.44
  Top 0.508: 56.33,53.7 51.5,48.87 51.3,48.87 | CAN_OUT.2 38.88,48.56 46.91,56.59 53.67,56.59 56.56,53.7 JGAUGE.2
CAN_STBY
  Top 0.406: IC7.5 49.38,43.12 48.37,44.13 48.37,45.02 46.59,46.8 29.56,46.8 28.32,45.56 28.32,42.47
  Top 0.508: IC4.10 28.32,42.47
DTR
  Top 0.305: 5.83,43.42 C21.2
  Top 0.508: DTR.1 5.67,43.26 5.83,43.42
ERROR_LED  (1 unrouted)
  Top 0.508: 27.52,42.51 27.52,52.81 ERROR.C
GND  (via drill 0.35)  (2 unrouted)
  Top 0.203: U$5.GND1 47.18,39.81 47.18,37.69 C9.1 | U$5.GND2 45.14,41.76
  Top 0.305: U$4.GND1 33.41,44.47 | 35.31,42.57 U$4.GND2 | C5.1 29.56,23.07 IC2.10 | IC2.21 25.49,22.42 | IC2.21 26.14,23.07 | IC2.21 25.81,21.77 26.48,21.1 | IC2.21 26.14,20.47 | IC2.21 23.54,20.47 | IC2.21 24.19,22.42 | TGND.2 31.17,15.45 31.12,15.5 | 45.14,41.76 47.27,39.63
  Top 0.406: C14.1 61.69,44.41 IC7.26 | C20.2 56.6,48.43 v58.18,48.43 | v54.67,42.55 54.67,40.89 53.65,39.87 IC7.10 51.65,39.85 47.23,39.85 47.18,39.81
  Top 0.508: 30.6,38.56 IC4.5 | 35.35,42.46 U$4.GND2 | 37.64,42.57 C7.1 | C23.2 19.37,37.81 | R30.2 52.45,24.79 | R19.2 C24.2 R20.2 C15.2 | MAP_SNSR.1 | C9.1 47.13,39.49 47.27,39.63 | C8.1 44.99,42.52 | 44.98,42.6 U$5.GND2 | IC4.21 22.09,37.79 | v63.5,44 62.1,44 C14.1 61.94,44.12 C22.1 | JGAUGE.1 59.23,51.53 | 69.11,41 68.02,39.91 68.02,29.37 76.09,29.37 76.44,29.72 76.44,40.07 68.49,40.07 | 81.7,14.3 85.3,14.3 | 83.6,16 83.6,12.6 | v69.5,38.9 69.5,32.77 68.39,31.66 | 65.2,47.92 65.32,47.8 v67.52,47.8 67.05,47.33 65.18,47.33
  Top 1.016: Q1.1 Q1.3 | Q1.2 64.67,21.18 64.96,20.88 R21.2 70.59,20.88 C11.2 | JGAUGE.1 59.23,50.64 60.19,49.68 C16.1 65.25,48.54 66.88,48.54 | 66.88,48.54 67.56,47.86 67.56,47.71 | 66.88,48.54 67.3,48.54 67.52,48.76 v67.52,48.83
  Bottom 0.406: v63.5,44 59.07,48.43 v58.18,48.43 54.67,44.92 v54.67,42.55
  Bottom 0.508: 67.24,44 67.36,43.88 | v63.5,44 63.48,43.98 | 69.26,36.14 v69.5,35.9
  Bottom 1.016: v67.52,47.8 67.62,47.7
  Bottom 1.27: 67.42,48.66 65.29,48.66 65.29,47.75 65.36,47.68 67.3,47.68 67.31,47.69
  other vias: 69.5,41.9 71,41.9 75.5,41.9 77,41.9 78.5,41.9 69.5,43.4 71,43.4 75.5,43.4 77,43.4 78.5,43.4 69.5,44.9 71,44.9 75.5,44.9 77,44.9 78.5,44.9 69.5,46.4 71,46.4 77,46.4 69.5,40.4 71,40.4 75.5,40.4 77,40.4 78.5,40.4 68,31.4 69.5,31.4 71,31.4 72.5,31.4 74,31.4 75.5,31.4 77,31.4 78.5,31.4 68,32.9 69.5,32.9 71,32.9 72.5,32.9 74,32.9 75.5,32.9 77,32.9 78.5,32.9 68,34.4 69.5,34.4 71,34.4 72.5,34.4 74,34.4 75.5,34.4 77,34.4 78.5,34.4 71,35.9 72.5,35.9 74,35.9 75.5,35.9 77,35.9 78.5,35.9 69.5,37.4 71,37.4 72.5,37.4 74,37.4 75.5,37.4 71,38.9 72.5,38.9 74,38.9 75.5,38.9 68,29.9 69.5,29.9 71,29.9 72.5,29.9 74,29.9 75.5,29.9 77,29.9 78.5,29.9 75.5,20.9 75.5,22.4 69.5,23.9 71,23.9 72.5,23.9 74,23.9 75.5,23.9 77,23.9 69.5,25.4 71,25.4 72.5,25.4 74,25.4 75.5,25.4 77,25.4 69.5,26.9 71,26.9 72.5,26.9 74,26.9 75.5,26.9 69.5,28.4 71,28.4 72.5,28.4 74,28.4 75.5,28.4 69.5,19.4 71,19.4 72.5,19.4 74,19.4 75.5,19.4 77,19.4 78.5,19.4 80,19.4 69.5,16.4 71,16.4 72.5,16.4 74,16.4 75.5,16.4 77,16.4 69.5,17.9 71,17.9 72.5,17.9 74,17.9 75.5,17.9 77,17.9 78.5,17.9 47.35,52.69 68,37.36 68,35.86 10.66,24.6 16.53,32.35 34.16,28.55 39.79,40.46 51.18,32.1 61.85,36.21 77.02,38.92 78.52,38.92 77.02,37.42 78.52,37.42 82.81,46.43 82.81,47.93 81.31,46.43 81.31,47.93 79.81,47.93 84.31,46.43 84.31,47.93 85.79,46.45 85.79,47.95 84.24,41.85 85.74,41.85 84.24,43.35 85.74,43.35 84.24,44.85 85.74,44.85 84.24,40.35 85.74,40.35 84.26,38.87 85.76,38.87 81.29,49.31 79.79,49.31 79.79,50.81 85.77,49.33 85.77,50.83
  pour Top (isolate 0.2, no thermals): 23.12,23.48 23.12,20.38 21.52,18.78 18.08,18.78 17.49,18.19 17.49,12.75 18.24,12 30.08,12 31.79,13.71 31.79,18.54 31.51,18.82 27.98,18.82 26.6,20.2 26.6,23.48
  pour Top (rank 2): -0.42,63.2 -0.42,0.01 1.39,-1.8 2.43,-0.76 63.14,-0.76 63.14,30.37 65.69,32.92 65.69,63.23 65.45,63.47 0.12,63.47 -0.15,63.2
  pour Top: 67.59,63.3 67.19,62.9 67.19,0.82 69.01,-1 88.06,-1 88.54,-0.52 88.54,63.23 88.32,63.45 67.73,63.45 67.59,63.31
  pour Bottom: 67.12,63.19 67.12,-2.82 67.59,-3.29 86.98,-3.29 89.15,-1.12 89.15,61.39 85.91,64.63 68.56,64.63
  pour Bottom (rank 2): 65.72,55.58 65.72,63.22 65.74,63.24 -0.72,63.24 -0.85,63.37 -0.85,0.45 0.57,-0.97 62.46,-0.97 63.05,-0.38 63.05,30 65.85,32.8 65.85,55.44 65.71,55.58
MAP_IN
  Top 0.508: MAP_SNSR.4 2.46,16.53 2.46,22.4 | IC4.23 19.7,36.21 C15.1 R19.1 12.79,35.58 2.46,25.25 2.46,22.4 | C13.1 4.63,22.4 2.46,22.4
N$1  (via drill 0.35)
  Top 0.406: v48.62,40.71 48.81,40.52 IC7.9 | v43.52,39.81 43.57,39.86 U$5.XTAL2 | 44.98,38.05 45.31,37.72
  Top 0.508: C9.2 45.27,37.68 | 45.27,37.68 45.31,37.72 | 45.27,37.68 45.27,37.92 | 45.25,39.59 U$5.XTAL2 44.98,38.05
  Bottom 0.406: v48.62,40.71 44.42,40.71 v43.52,39.81
N$3
  Top 0.152: R15.1 R3.1
  Top 0.508: R3.1 41.21,20.32 41.21,24.87 Q2.B
N$4
  Top 0.152: R16.1 R2.1
  Top 0.508: Q3.B 47.38,24.75 46.67,24.75 45.7,23.78 R2.1
N$5
  Top 0.406: IC7.8 49.73,41.16 49.13,41.76 U$5.XTAL1
  Top 0.508: C8.2 46.9,42.04 U$5.XTAL1
N$6
  Top 1.016: D1.C 82.06,24.8 79.17,21.92 C11.1 78.94,22.43 C1.1 83.16,32.23 | IC1.1 83.16,32.23 | D2.C 85.42,32.23 83.16,32.23
N$8  (via drill 0.35)
  Top 0.508: IC4.31 28.32,33.98 28.32,35.13 v28.12,35.33 | v9.2,40.87 R8.2
  Bottom 0.508: v28.12,35.33 23.64,35.33 18.1,40.87 v9.2,40.87
N$9  (via drill 0.35)
  Top 0.508: IC4.30 27.51,32.87 v27.9,32.48 | v9.39,38.14 7.8,38.14 R7.2
  Bottom 0.508: v27.9,32.48 25.02,32.48 19.36,38.14 v9.39,38.14
N$10
  Top 0.508: MCU_OK.A 23.91,59.12 25.74,57.29 R9.1
N$11
  Top 0.305: R13.2 18.96,15.13 19.66,14.43 K_TYPE.1
N$12
  Top 0.508: ERROR.A 31.22,59.02 29.51,57.31 R23.1
N$13
  Top 0.406: IC7.18 58.78,39.2 61.41,39.2 C22.2 R24.1
N$15
  Top 0.305: R14.2 19.19,25.2 21.32,23.07 IC2.16
N$23  (via drill 0.35)
  Top 0.406: IC4.25 23.51,32.13 v23.48,32.1
  Top 0.508: R30.1 52.5,22.29 51.32,21.11 v51.32,20.93 51.03,20.64 R22.2
  Bottom 0.406: v23.48,32.1 34.65,20.93 v51.32,20.93
N$24
  Top 0.508: C7.2 37.64,44.47 U$4.XTAL2 35.5,44.51 35.5,45.94 32.13,45.94 31.85,45.66 31.85,41.75 31.11,41.01 IC4.8
N$25
  Top 0.508: U$4.XTAL1 33.26,40.49 C6.2 33.36,40.21 IC4.7
N$32  (via drill 0.35)
  Top 0.508: IC4.13 25.91,41.63 26.87,40.68 v27.7,40.68 | v66.15,29.76 66.15,27.66 66.4,27.41 R29.2
  Bottom 0.508: v27.7,40.68 27.71,40.68 28.8,41.77 48.91,41.77 54.02,36.65 59.27,36.65 v66.15,29.76
NTC_IN
  Top 0.508: 4.32,18.38 4.43,18.38 MAP_SNSR.2 5.14,18.54 6.76,20.16 6.76,21.8 7.43,22.47 C25.1 9.09,22.65 13.61,22.65 R1.2 13.99,26.63 C24.1 R20.1 20.55,29.18 21.1,29.73 21.1,35.14 21.37,35.41 IC4.24
POWER_ON
  Top 0.508: MCU_OK.C 23.91,55.86 26.71,53.06 IC4.12
RESET  (via drill 0.35)
  Top 0.305: v26.7,37.3 v26.71,37.29 IC4.29 | SV1.5 8.12,43.72 C21.1
  Top 0.508: R18.2 26.7,31.57 IC4.29
  Bottom 0.305: v26.7,37.3 v26.69,37.3 21.95,42.04 17.69,42.04 16.65,43.08 SV1.5
RPM_ISO  (via drill 0.35)
  Top 0.508: IC4.3 31.64,37.01 32.46,36.19 32.46,34.33 v32.43,34.3 | 41.18,26.96 Q2.E 40.65,27.32 R4.2 40.29,29 39.35,29.94 v38.87,29.94
  Bottom 0.508: v38.87,29.94 36.8,29.94 v32.44,34.3 v32.43,34.3
RPM_SIGNAL
  Top 0.508: ANALOG_IN.1 39.23,16.49 C17.1 R3.2
RXCAN
  Top 0.406: IC7.28 57.41,45.72 56.83,45.14 56.83,41.58 57.24,41.16 IC7.21
RXD
  Top 0.508: TXD.1 5.73,40.79 R8.1
SCL  (via drill 0.35)
  Top 0.305: R10.2 18.88,22.82 20.58,21.12 | 20.58,21.12 IC2.19 | v20.87,21.79 20.87,21.41 20.58,21.12
  Top 0.406: IC4.28 25.9,33.96 25.9,30.1 25.21,29.41 25.21,28.78 v25.15,28.72
  Bottom 0.406: v25.15,28.72 v25.14,28.71 25.14,25.95 20.98,21.79 v20.87,21.79
SDA  (via drill 0.35)
  Top 0.305: 18.42,20.31 R11.2 18.52,20.47 19.9,20.47 | IC2.20 19.9,20.47 | v19.9,19.79 19.9,20.47
  Top 0.406: IC4.27 25.11,30.53 23.95,29.37 v23.95,28.97
  Bottom 0.406: v19.9,19.79 19.68,20.01 19.68,21.88 23.94,26.14 v23.94,28.96 v23.95,28.97
SPI_CLK  (via drill 0.35)
  Top 0.305: v22.29,43.31 20.61,44.99 17.92,44.99 SV1.3
  Top 0.406: v53.92,38.01 53.81,38.01 53.07,37.27 IC7.14
  Top 0.508: IC4.17 22.29,41.23 v22.29,43.31
  Bottom 0.406: v22.29,43.31 22.65,42.95 48.94,42.95 53.88,38.01 v53.92,38.01
SPI_CS  (via drill 0.35)
  Top 0.406: IC4.14 25.11,45.52 v24.64,45.99 | IC7.17 57.2,38.56 v55.94,39.82
  Bottom 0.406: v24.64,45.99 24.94,45.99 25.58,45.35 50.41,45.35 v55.94,39.82
SPI_MISO  (via drill 0.35)
  Top 0.305: SV1.1 17.93,47.52 21.19,47.52 23.45,45.26 v23.45,45.19
  Top 0.406: IC4.16 23.45,42.51 v23.45,45.19 | v55.69,38.75 55.79,38.75 56.63,37.91 IC7.16
  Bottom 0.406: v23.45,45.19 23.56,45.08 24.47,45.08 25.04,44.52 49.87,44.52 55.63,38.75 v55.69,38.75
SPI_MOSI  (via drill 0.35)
  Top 0.406: IC7.15 55.88,37.27 v55.72,37.43 | v24.27,44.03 v24.28,44.02 24.28,42.48 IC4.15
  Bottom 0.305: SV1.4 20.62,46.26 23.19,43.69 24.15,43.69 24.27,43.81 v24.27,44.03
  Bottom 0.406: v55.72,37.43 49.42,43.73 24.57,43.73 v24.27,44.03
TACH_ISO  (via drill 0.35)
  Top 0.508: v23.75,38.97 23.31,39.41 IC4.19 | 47.57,27 Q3.E 47.51,27.08 47.49,28.91 R6.2 47.43,28.85 v45.66,28.85
  Bottom 0.508: v23.75,38.97 23.75,38.94 26.53,36.16 28.52,36.16 35.81,28.87 45.64,28.87 v45.66,28.85
TACH_SIGNAL
  Top 0.508: C18.1 47.63,17.79 47.63,17.48 | 47.63,17.48 47.63,16.63 ANALOG_IN.2 | R2.2 47.6,17.51 47.63,17.48
THERMO+
  Top 0.305: R13.1 C4.2 24.19,17.76 IC2.2
THERMO-
  Top 0.305: IC2.4 25.49,17.56 C4.1 R12.1
THERMO-1
  Top 0.305: K_TYPE.2 29.96,14.43 30.53,15 R12.2 32.78,17.36 TGND.1
TXCAN
  Top 0.406: IC7.24 59.94,43.12 60.33,42.72 60.33,40.9 59.95,40.52 IC7.20
TXD
  Top 0.508: RXD.1 5.78,38.26 R7.1

### Text on the board
tPlace: IAT | GND | MAP | 5V | RPM | TACH | GND | 12V
tNames: OpenTG Boost / Controller Mainboard / By Kostas Anes / / HRD v0.1 | MAP PINOUT | A_IN PINOUT | BST PINOUT